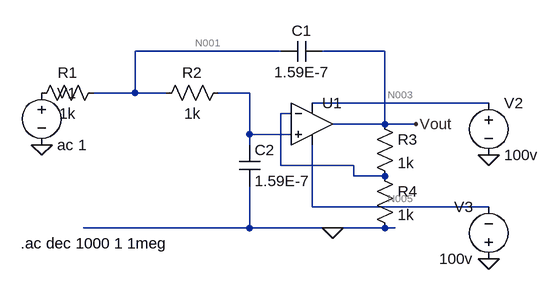
[diagram p0: schematic SallenKey2ndOrder.asc]
SallenKey2ndOrder.asc, the LTspice schematic file:
Version 4
SHEET 1 880 680
WIRE 288 -80 64 -80
WIRE 448 -80 352 -80
WIRE 64 -16 64 -80
WIRE 64 -16 0 -16
WIRE 112 -16 64 -16
WIRE 240 -16 192 -16
WIRE 608 0 336 0
WIRE 304 16 288 16
WIRE 448 32 448 -80
WIRE 448 32 368 32
WIRE 496 32 448 32
WIRE 240 48 240 -16
WIRE 304 48 240 48
WIRE 240 64 240 48
WIRE 288 96 288 16
WIRE 400 96 288 96
WIRE 400 112 400 96
WIRE 448 112 400 112
WIRE 336 160 336 64
WIRE 608 160 336 160
WIRE 240 192 240 128
WIRE 240 192 -16 192
WIRE 368 192 240 192
WIRE 448 192 368 192
WIRE 464 192 448 192
FLAG 368 192 0
FLAG -80 64 0
FLAG 496 32 Vout
FLAG 608 80 0
FLAG 608 240 0
SYMBOL res 16 -32 R90
WINDOW 0 0 56 VBottom 2
WINDOW 3 32 56 VTop 2
SYMATTR InstName R1
SYMATTR Value 1k
SYMBOL res 208 -32 R90
WINDOW 0 0 56 VBottom 2
WINDOW 3 32 56 VTop 2
SYMATTR InstName R2
SYMATTR Value 1k
SYMBOL cap 352 -96 R90
WINDOW 0 0 32 VBottom 2
WINDOW 3 32 32 VTop 2
SYMATTR InstName C1
SYMATTR Value 1.59E-7
SYMBOL cap 224 64 R0
SYMATTR InstName C2
SYMATTR Value 1.59E-7
SYMBOL voltage -80 -32 R0
SYMATTR InstName V1
SYMATTR Value ac 1
SYMBOL voltage 608 -16 R0
SYMATTR InstName V2
SYMATTR Value 100v
SYMBOL voltage 608 256 R180
WINDOW 0 24 96 Left 2
WINDOW 3 24 16 Left 2
WINDOW 123 0 0 Left 0
WINDOW 39 0 0 Left 0
SYMATTR InstName V3
SYMATTR Value 100v
SYMBOL res 432 16 R0
SYMATTR InstName R3
SYMATTR Value 1k
SYMBOL res 432 96 R0
SYMATTR InstName R4
SYMATTR Value 1k
SYMBOL OpAmps\\UniversalOpamp2 336 32 R0
SYMATTR InstName U1
TEXT -112 216 Left 2 !.ac dec 1000 1 1meg

The netlist it stands for:
* SallenKey2ndOrder.asc
R1 N001 P001 1k
R2 N002 N001 1k
C1 Vout N001 1.59E-7
C2 N002 0 1.59E-7
V1 P001 0 ac 1
V2 N003 0 100v
V3 0 N005 100v
R3 Vout N004 1k
R4 N004 0 1k
XU1 N002 N004 N003 N005 Vout level.2 Avol=1Meg GBW=10Meg Slew=10Meg ilimit=25m rail=0 Vos=0 phimargin=45 en=0 enk=0 in=0 ink=0 Rin=500Meg  ; pins IN+ IN- V+ V- OUT
.ac dec 1000 1 1meg
.lib UniversalOpamps2.sub
.backanno
.end

* Results of the author's LTspice run, read from the files saved beside the schematic
* Operating Point, zero values left out:
*   V(n003) = 100 V
*   V(n005) = -100 V
*   I(V3) = -100 µA
*   I(V2) = -100 µA
*   Ix(u1:3) = 100 µA
*   Ix(u1:4) = -100 µA
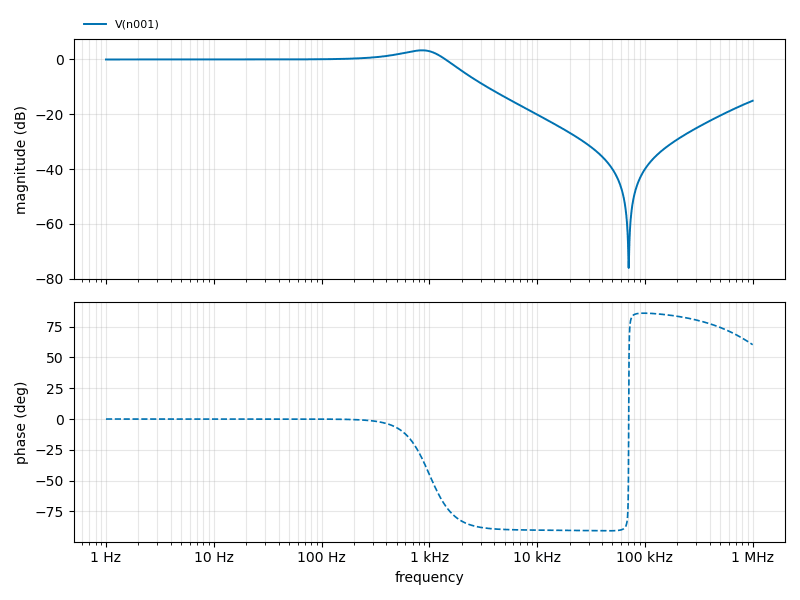
[diagram p1: AC Analysis of SallenKey2ndOrder.asc, plotted from the saved traces]
* AC Analysis, 1 run:
*   V(n001): -0.00 dB at 1 Hz, -15.06 dB at 1 MHz, peak 3.34 dB at 857 Hz, 3 dB below the peak at 195.8 Hz and 1.375 kHz